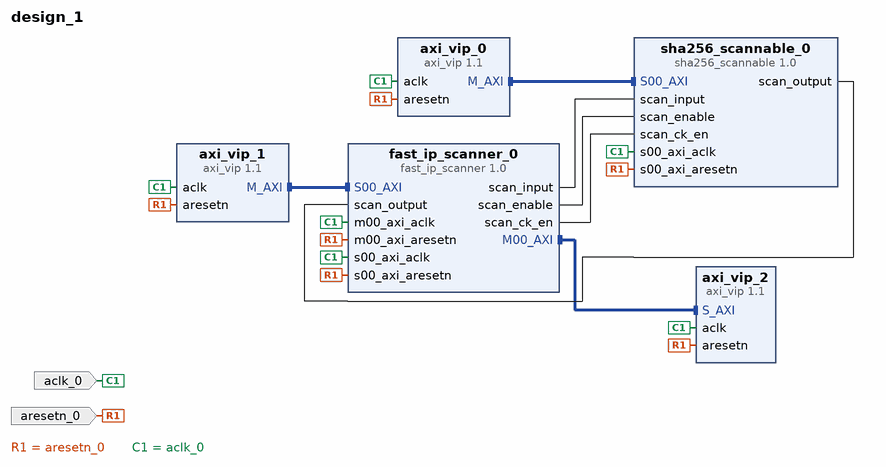
[diagram p0: block diagram of the top level]
# Vivado block design design_1, xc7z020clg484-1, Vivado 2019.1
create_bd_design design_1

create_bd_port -dir I -type rst aresetn_0
create_bd_port -dir I -type clk aclk_0

create_bd_cell -type ip -vlnv user.org:user:fast_ip_scanner:1.0 fast_ip_scanner_0
create_bd_cell -type ip -vlnv xilinx.com:ip:axi_vip:1.1 axi_vip_0
set_property -dict [list \
  CONFIG.ADDR_WIDTH 32 \
  CONFIG.DATA_WIDTH 32 \
  CONFIG.HAS_BRESP 1 \
  CONFIG.HAS_PROT 1 \
  CONFIG.HAS_RRESP 1 \
  CONFIG.HAS_WSTRB 1 \
  CONFIG.INTERFACE_MODE MASTER \
  CONFIG.PROTOCOL AXI4LITE \
  CONFIG.READ_WRITE_MODE READ_WRITE \
] [get_bd_cells axi_vip_0]
create_bd_cell -type ip -vlnv xilinx.com:ip:axi_vip:1.1 axi_vip_1
set_property -dict [list \
  CONFIG.ADDR_WIDTH 32 \
  CONFIG.DATA_WIDTH 32 \
  CONFIG.HAS_BRESP 1 \
  CONFIG.HAS_PROT 1 \
  CONFIG.HAS_RRESP 1 \
  CONFIG.HAS_WSTRB 1 \
  CONFIG.INTERFACE_MODE MASTER \
  CONFIG.PROTOCOL AXI4LITE \
  CONFIG.READ_WRITE_MODE READ_WRITE \
] [get_bd_cells axi_vip_1]
create_bd_cell -type ip -vlnv xilinx.com:ip:axi_vip:1.1 axi_vip_2
set_property -dict [list \
  CONFIG.ADDR_WIDTH 32 \
  CONFIG.DATA_WIDTH 32 \
  CONFIG.INTERFACE_MODE SLAVE \
  CONFIG.PROTOCOL AXI4LITE \
  CONFIG.READ_WRITE_MODE READ_WRITE \
] [get_bd_cells axi_vip_2]
create_bd_cell -type ip -vlnv user.org:user:sha256_scannable:1.0 sha256_scannable_0

# ---- connections ----

connect_bd_intf_net [get_bd_intf_pins axi_vip_0/M_AXI] [get_bd_intf_pins sha256_scannable_0/S00_AXI]
connect_bd_intf_net [get_bd_intf_pins axi_vip_2/S_AXI] [get_bd_intf_pins fast_ip_scanner_0/M00_AXI]
connect_bd_intf_net [get_bd_intf_pins fast_ip_scanner_0/S00_AXI] [get_bd_intf_pins axi_vip_1/M_AXI]
connect_bd_net [get_bd_pins sha256_scannable_0/scan_output] [get_bd_pins fast_ip_scanner_0/scan_output]
connect_bd_net [get_bd_pins fast_ip_scanner_0/scan_input] [get_bd_pins sha256_scannable_0/scan_input]
connect_bd_net [get_bd_pins fast_ip_scanner_0/scan_enable] [get_bd_pins sha256_scannable_0/scan_enable]
connect_bd_net [get_bd_pins fast_ip_scanner_0/scan_ck_en] [get_bd_pins sha256_scannable_0/scan_ck_en]
connect_bd_net -net aresetn_0_1 [get_bd_ports aresetn_0] \
  [get_bd_pins axi_vip_1/aresetn] [get_bd_pins axi_vip_0/aresetn] [get_bd_pins fast_ip_scanner_0/m00_axi_aresetn] \
  [get_bd_pins fast_ip_scanner_0/s00_axi_aresetn] [get_bd_pins axi_vip_2/aresetn] \
  [get_bd_pins sha256_scannable_0/s00_axi_aresetn]
connect_bd_net -net aclk_0_1 [get_bd_ports aclk_0] \
  [get_bd_pins axi_vip_1/aclk] [get_bd_pins axi_vip_0/aclk] [get_bd_pins fast_ip_scanner_0/m00_axi_aclk] \
  [get_bd_pins fast_ip_scanner_0/s00_axi_aclk] [get_bd_pins axi_vip_2/aclk] [get_bd_pins sha256_scannable_0/s00_axi_aclk]

# ---- address map ----
assign_bd_address -offset 0x44A00000 -range 4K -target_address_space [get_bd_addr_spaces axi_vip_0/Master_AXI] [get_bd_addr_segs sha256_scannable_0/S00_AXI/S00_AXI_reg]
assign_bd_address -offset 0x44C00000 -range 4K -target_address_space [get_bd_addr_spaces axi_vip_1/Master_AXI] [get_bd_addr_segs fast_ip_scanner_0/S00_AXI/S00_AXI_reg]
assign_bd_address -offset 0x00000000 -range 512M -target_address_space [get_bd_addr_spaces fast_ip_scanner_0/M00_AXI] [get_bd_addr_segs axi_vip_2/S_AXI/Reg]

validate_bd_design
save_bd_design
